# EasyEDA schematic TrenElectricEsquema.json
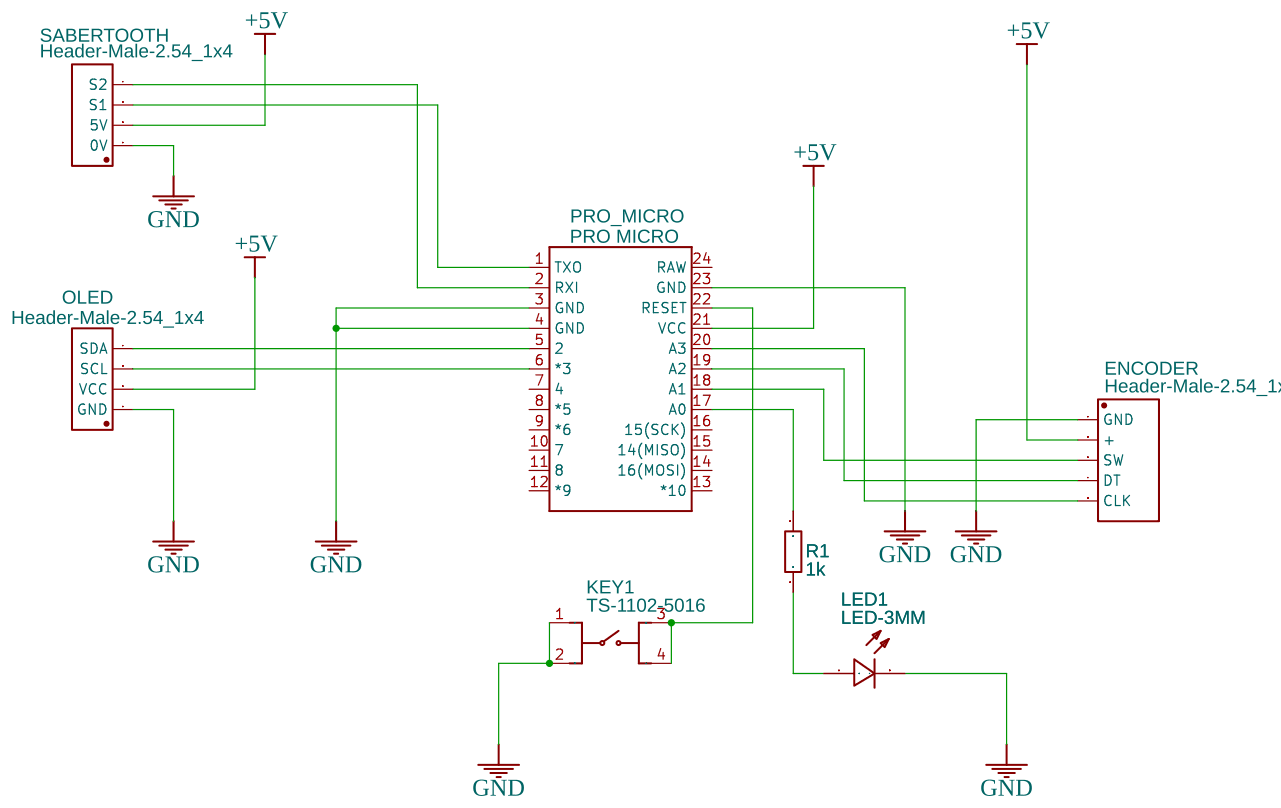
[diagram p0: schematic sheet]

## Parts
ENCODER  Header-Male-2.54_1x5  [DIP-1X5P-2.54MM-M]
KEY1  TS-1102-5016  [KEY-6.0*6.0-2]
LED1  LED-3MM  [LED-3MM/2.54]
OLED  Header-Male-2.54_1x4  [DIP-1X4P-2.54MM-M]
PRO_MICRO  PRO MICRO  [ARDUINO_PRO_MICRO]
R1  1k  [AXIAL-0.3]
SABERTOOTH  Header-Male-2.54_1x4  [DIP-1X4P-2.54MM-M]

## Library data of the parts
ENCODER = -: Supplier Part: C124379; Supplier: LCSC; Manufacturer: Ckmtw; Manufacturer Part: 210S-1*5P L=11.6MMGold-plated black; Contributor: LCSC
KEY1 = -: Supplier Part: C111609; Supplier: LCSC; Manufacturer: SOFNG; Contributor: EasyEDA
LED1 = -: Supplier Part: C99772; Supplier: LCSC; Manufacturer: EVERLIGHT; Manufacturer Part: 204-10SURD/S530-A3
OLED SABERTOOTH = -: Supplier Part: C124378; Supplier: LCSC; Manufacturer: Ckmtw; Manufacturer Part: 210S-1*4P L=11.6MMGold-plated black; Contributor: LCSC
PRO_MICRO = -: Contributor: SparkFun; Manufacturer Part: ?
R1 = Res_AXIAL-0.3(1/8W)_EU: Manufacturer Part: ?

## Nets
+5V: ENCODER.2(+) OLED.2(VCC) PRO_MICRO.21(VCC) SABERTOOTH.2(5V)
GND: ENCODER.1(GND) KEY1.1 KEY1.2 LED1.2(-) OLED.1(GND) PRO_MICRO.3(GND) PRO_MICRO.4(GND) PRO_MICRO.23(GND) SABERTOOTH.1(0V)
Net-(ENCODER-3): ENCODER.3(SW) PRO_MICRO.18(A1)
Net-(ENCODER-4): ENCODER.4(DT) PRO_MICRO.19(A2)
Net-(ENCODER-5): ENCODER.5(CLK) PRO_MICRO.20(A3)
Net-(KEY1-3): KEY1.3 KEY1.4 PRO_MICRO.22(RESET)
Net-(LED1-1): LED1.1(+) R1.1
Net-(OLED-3): OLED.3(SCL) PRO_MICRO.6(*3)
Net-(OLED-4): OLED.4(SDA) PRO_MICRO.5(2)
Net-(PRO_MICRO-1): PRO_MICRO.1(TXO) SABERTOOTH.3(S1)
Net-(PRO_MICRO-2): PRO_MICRO.2(RXI) SABERTOOTH.4(S2)
Net-(PRO_MICRO-17): PRO_MICRO.17(A0) R1.2

Not connected (* = marked no-connect by the designer): PRO_MICRO 7(4) 8(*5) 9(*6) 10(7) 11(8) 12(*9) 13(*10) 14(16(MOSI)) 15(14(MISO)) 16(15(SCK)) 24(RAW)
